# EAGLE schematic power_dist (EAGLE 9.6.0)
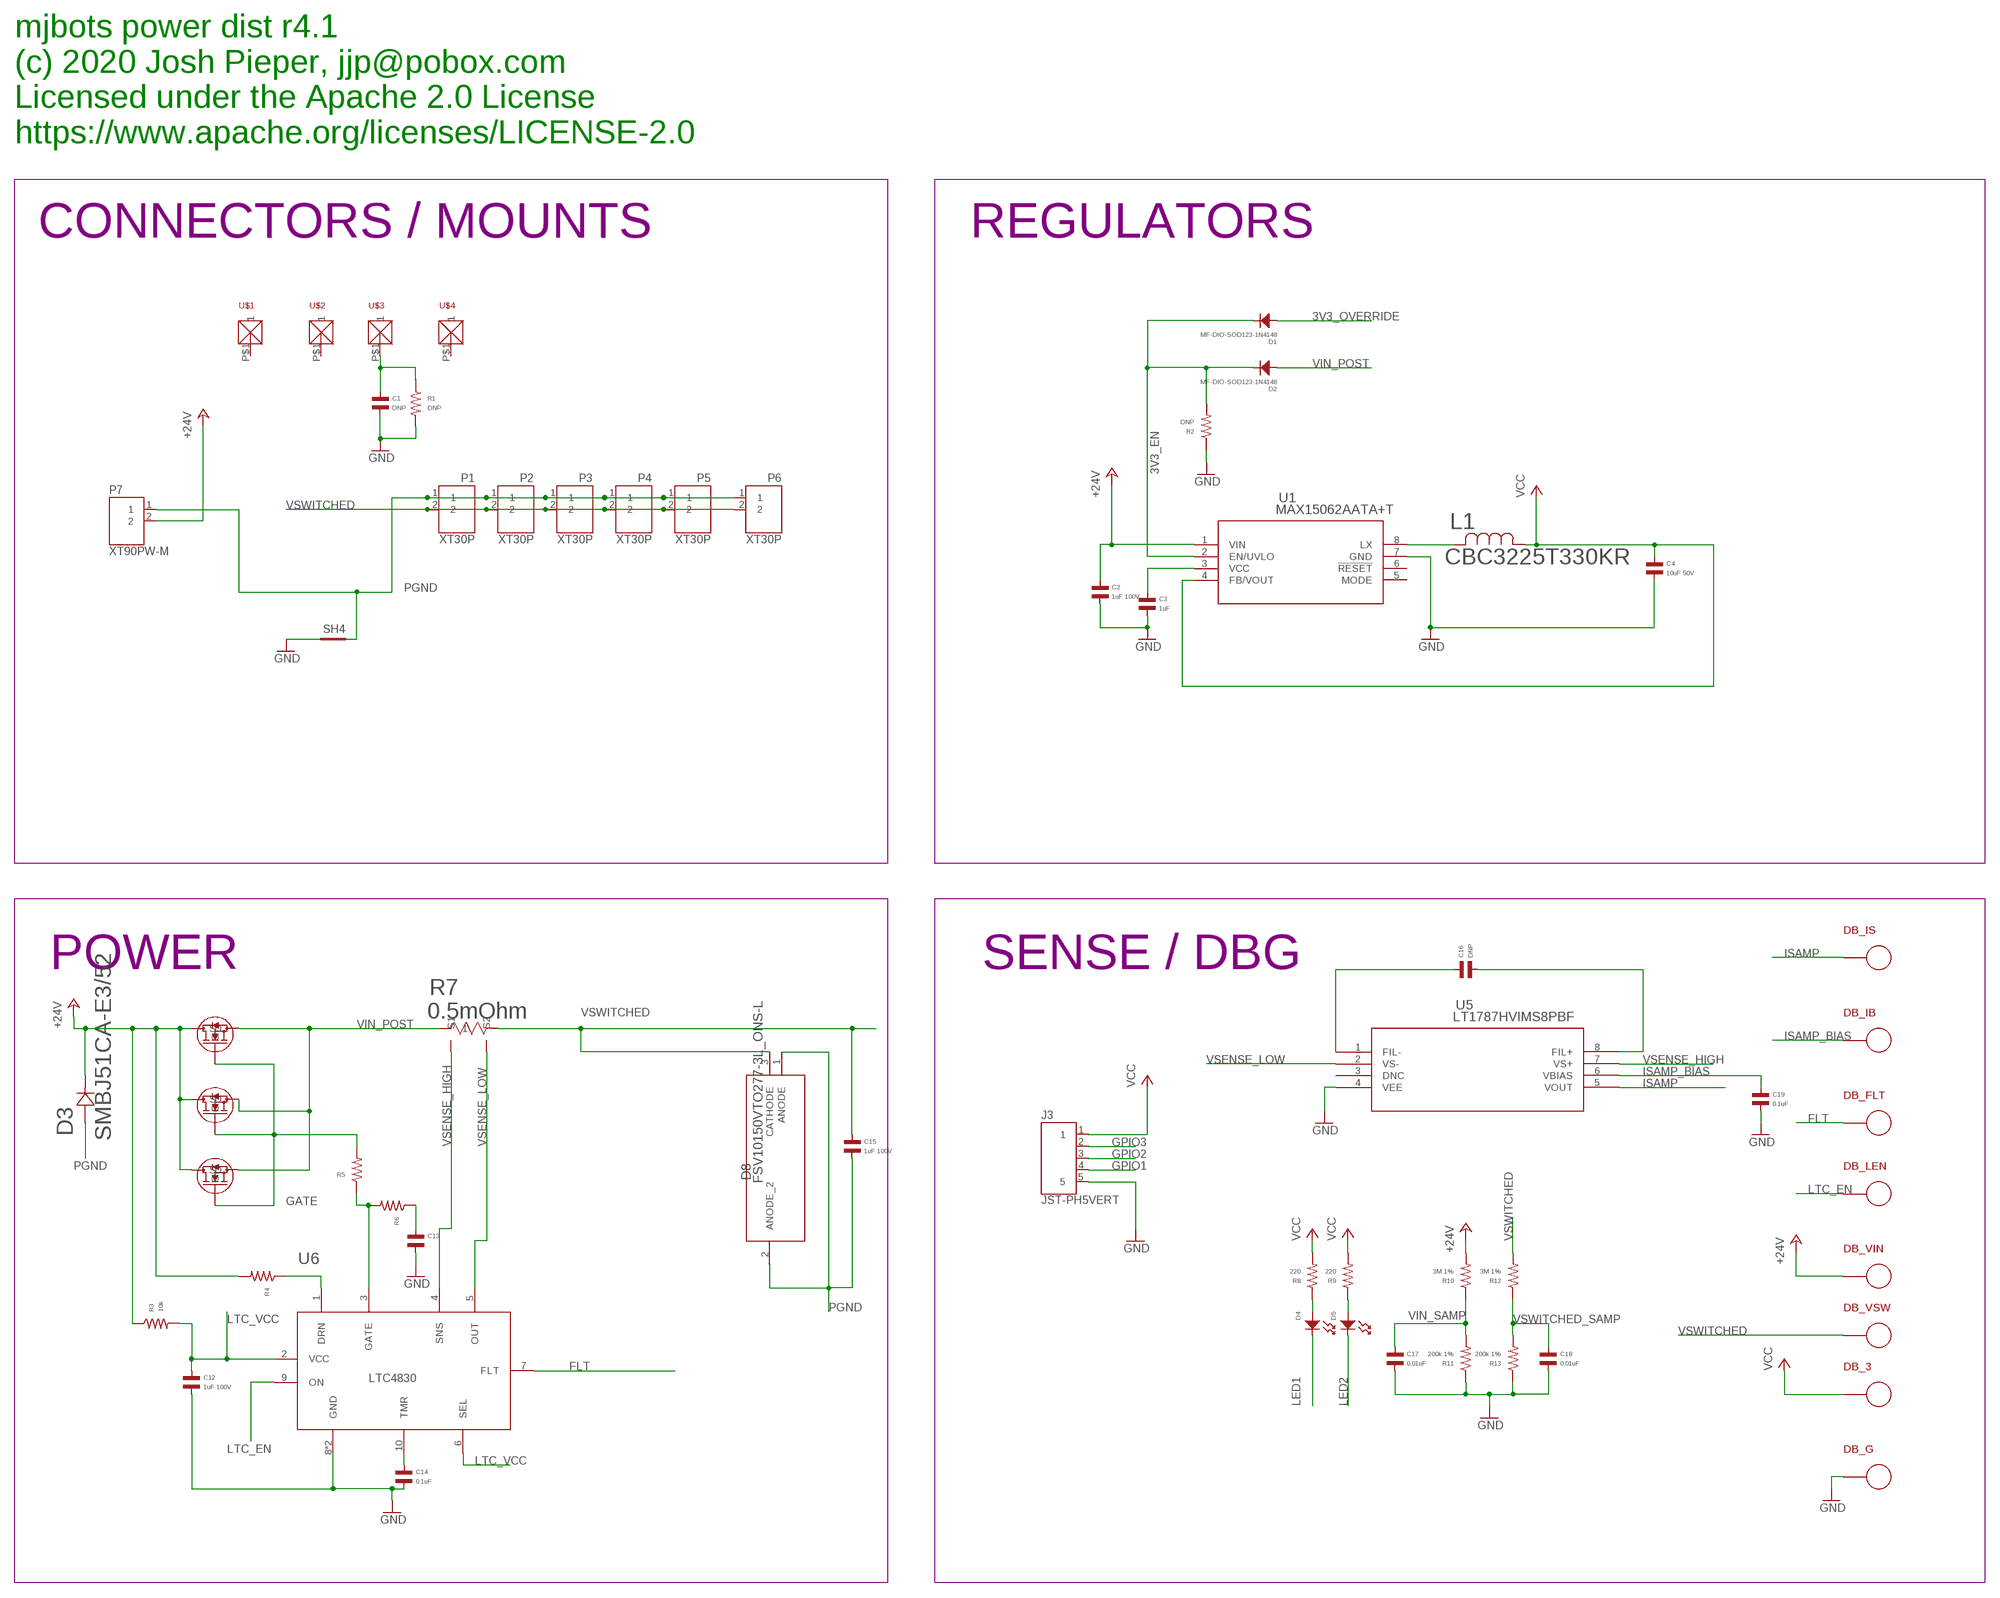
[diagram p0: schematic, sheet 1, part 1 of 2]
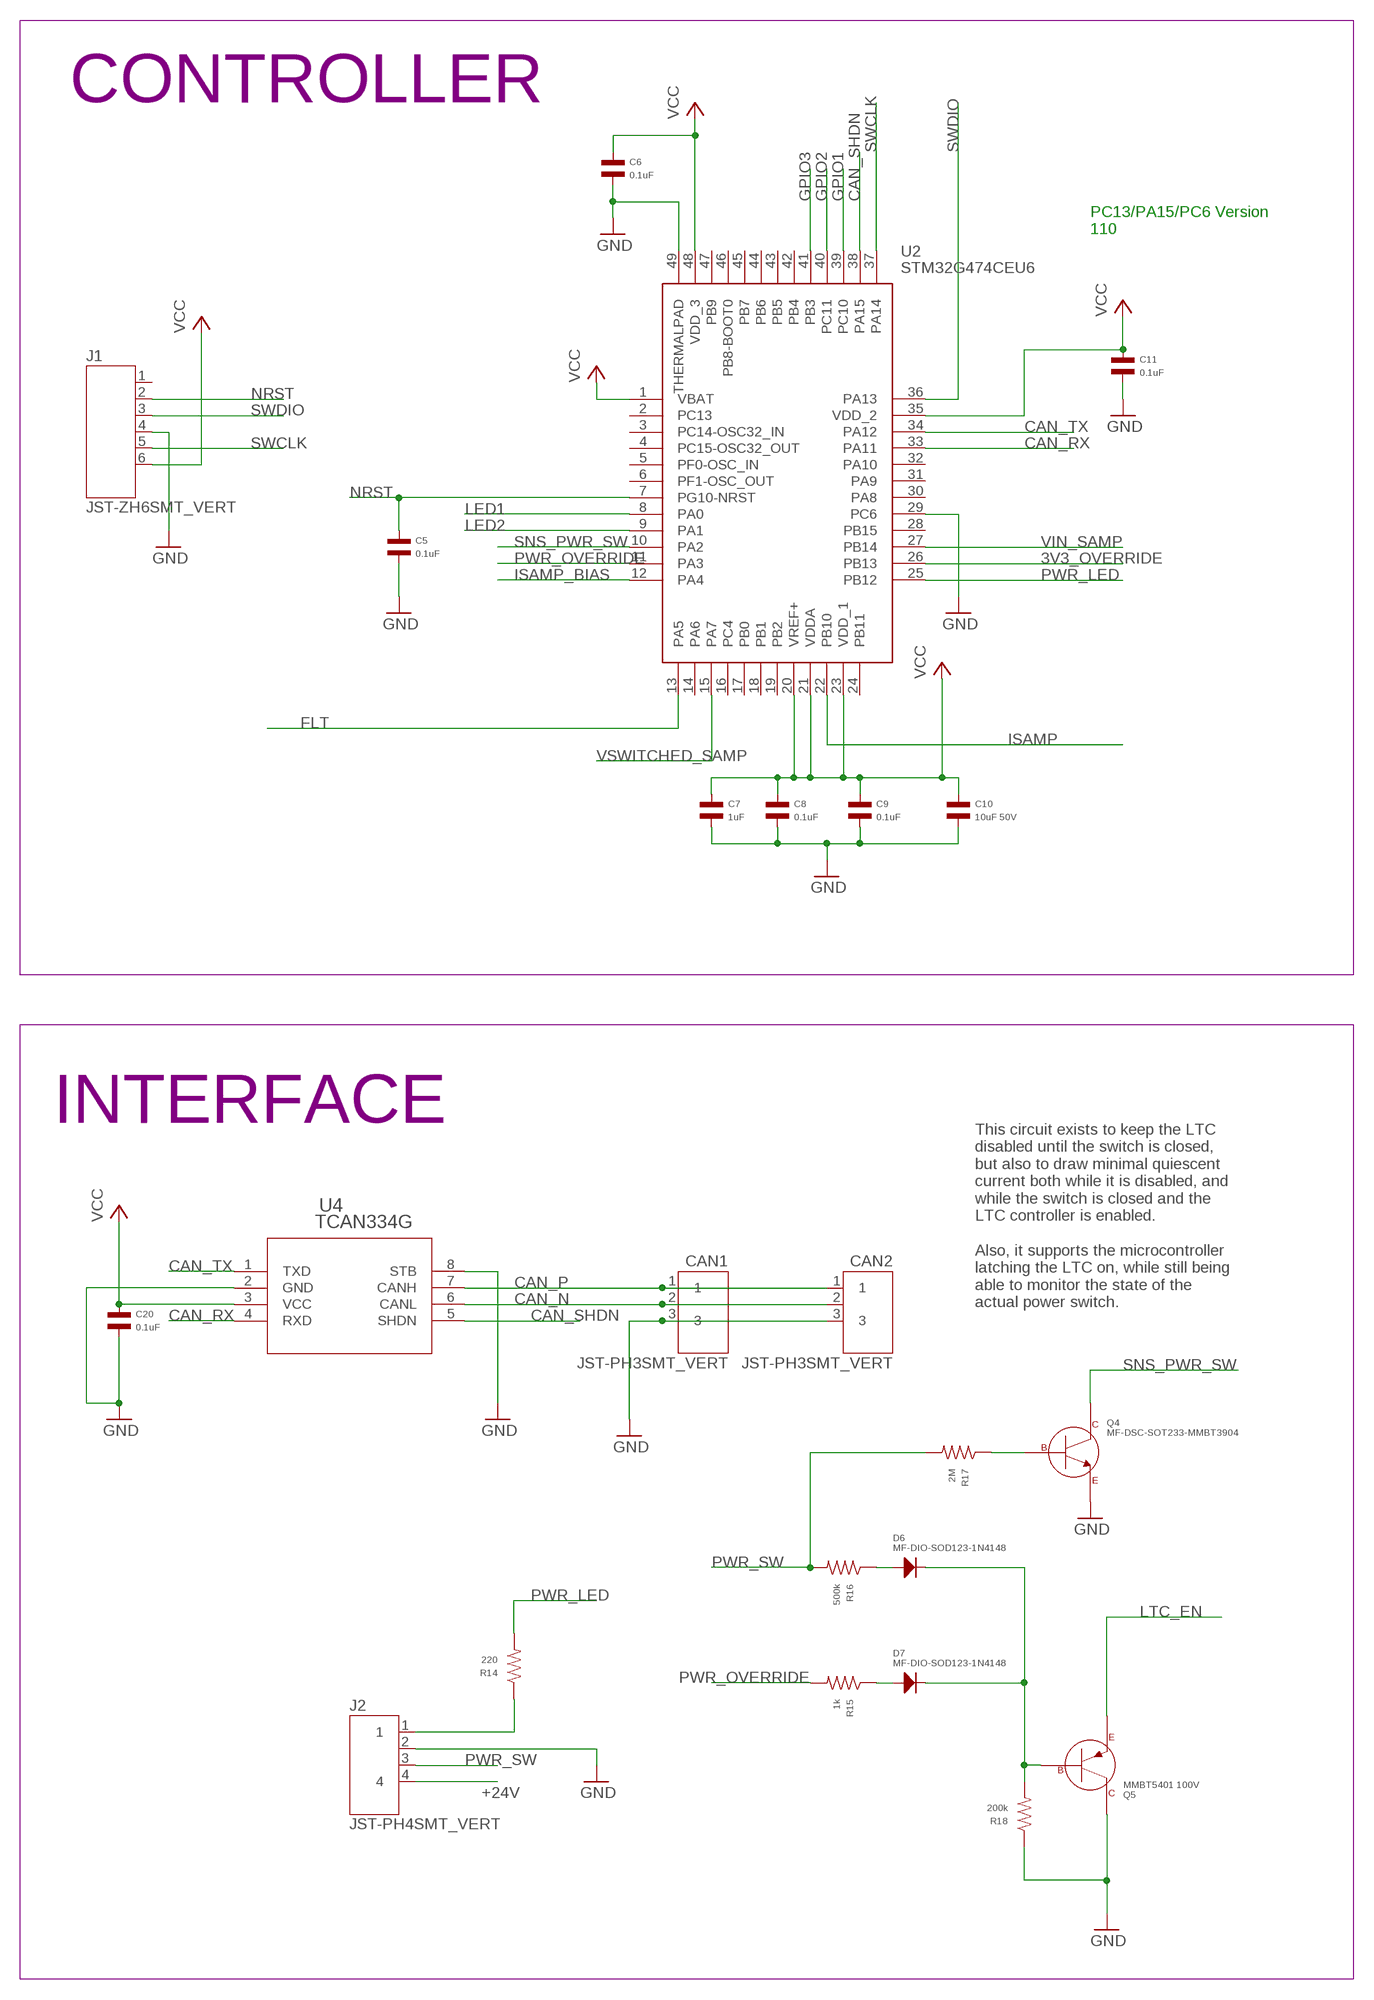
[diagram p1: schematic, sheet 1, part 2 of 2]

## Parts
C1  DNP  CAPACITOR_NP_0603  [C0603]
C2  1uF 100V  CAPACITOR_NP_0805  [C0805]
C3  1uF  CAPACITOR_NP_0603  [C0603]
C4  10uF 50V  CAPACITOR_NP_1206  [C1206]
C5  0.1uF  CAPACITOR_NP_0603  [C0603]
C6  0.1uF  CAPACITOR_NP_0603  [C0603]
C7  1uF  CAPACITOR_NP_0603  [C0603]
C8  0.1uF  CAPACITOR_NP_0603  [C0603]
C9  0.1uF  CAPACITOR_NP_0603  [C0603]
C10  10uF 50V  CAPACITOR_NP_1206  [C1206]
C11  0.1uF  CAPACITOR_NP_0603  [C0603]
C12  1uF 100V  CAPACITOR_NP_0805  [C0805]
C13  CAPACITOR_NP_0603  [C0603]
C14  0.1uF  CAPACITOR_NP_0603  [C0603]
C15  1uF 100V  CAPACITOR_NP_0805  [C0805]
C16  DNP  CAPACITOR_NP_0603  [C0603]
C17  0.01uF  CAPACITOR_NP_0603  [C0603]
C18  0.01uF  CAPACITOR_NP_0603  [C0603]
C19  0.1uF  CAPACITOR_NP_0603  [C0603]
C20  0.1uF  CAPACITOR_NP_0603  [C0603]
CAN1  JST-PH3SMT_VERT  [JST_B3B_PH-SM4-TB(LF)(SN)]
CAN2  JST-PH3SMT_VERT  [JST_B3B_PH-SM4-TB(LF)(SN)]
D1  MF-DIO-SOD123-1N4148  DIODES_1N4148_SOD-123  [SOD-123]
D2  MF-DIO-SOD123-1N4148  DIODES_1N4148_SOD-123  [SOD-123]
D3  SMBJ51CA-E3/52  [DIODE_DO-214AC]
D4  LED_SINGLE-0603  [LED0603]
D5  LED_SINGLE-0603  [LED0603]
D6  MF-DIO-SOD123-1N4148  DIODES_1N4148_SOD-123  [SOD-123]
D7  MF-DIO-SOD123-1N4148  DIODES_1N4148_SOD-123  [SOD-123]
D8  FSV10150VTO277-3L_ONS-L  [TO277-3L_ONS-L]
DB_3  PAD24AWG_PAD  [24AWG_PAD]
DB_FLT  PAD24AWG_PAD  [24AWG_PAD]
DB_G  PAD24AWG_PAD  [24AWG_PAD]
DB_IB  PAD24AWG_PAD  [24AWG_PAD]
DB_IS  PAD24AWG_PAD  [24AWG_PAD]
DB_LEN  PAD24AWG_PAD  [24AWG_PAD]
DB_VIN  PAD24AWG_PAD  [24AWG_PAD]
DB_VSW  PAD24AWG_PAD  [24AWG_PAD]
J1  JST-ZH6SMT_VERT  [JST_B6B-ZR-SM4-TF(LF)(SN)]
J2  JST-PH4SMT_VERT  [JST_B4B_PH-SM4-TB(LF)(SN)]
J3  JST-PH5VERT  [JST_B5B_PH-SM4-TB(LF)(SN)]
L1  CBC3225T330KR  [IND_TAIYO_CBC3225_TAY]
P1  XT30P  [XT30P]
P2  XT30P  [XT30P]
P3  XT30P  [XT30P]
P4  XT30P  [XT30P]
P5  XT30P  [XT30P]
P6  XT30P  [XT30P]
P7  XT90PW-M  [XT90PW-M]
Q1  PSMN4R8-100BSEJ  [D2PAK_SOT404_NEX]
Q2  PSMN4R8-100BSEJ  [D2PAK_SOT404_NEX]
Q3  PSMN4R8-100BSEJ  [D2PAK_SOT404_NEX]
Q4  MF-DSC-SOT233-MMBT3904  NPN_BJTMMBT3904_SOT-23-3  [SOT-23-3]
Q5  MMBT5401 100V  PNP_BJT_MMBT3906_SOT-23-3  [SOT-23-3]
R1  DNP  RESISTOR_0603  [R0603]
R2  DNP  RESISTOR_0603  [R0603]
R3  10k  RESISTOR_0603  [R0603]
R4  RESISTOR_0603  [R0603]
R5  RESISTOR_0603  [R0603]
R6  RESISTOR_0603  [R0603]
R7  0.5mOhm  SENSE_RESISTOR2512  [SHUNT2512]
R8  220  RESISTOR_0603  [R0603]
R9  220  RESISTOR_0603  [R0603]
R10  3M 1%  RESISTOR_0603  [R0603]
R11  200k 1%  RESISTOR_0603  [R0603]
R12  3M 1%  RESISTOR_0603  [R0603]
R13  200k 1%  RESISTOR_0603  [R0603]
R14  220  RESISTOR_0603  [R0603]
R15  1k  RESISTOR_0603  [R0603]
R16  500k  RESISTOR_0603  [R0603]
R17  2M  RESISTOR_0603  [R0603]
R18  200k  RESISTOR_0603  [R0603]
SH4  SHORTBIG  [SHORT_TOP-BIG]
U1  MAX15062AATA+T  [21-0487A_MXM]
U2  STM32G474CEU6  [QFN50P700X700X60-49N]
U4  TCAN334G  [SOIC8]
U5  LT1787HVIMS8PBF  [MSOP-8_MS]
U6  LTC4830  [DFN10]
U$1  MOUNT  [M2.5MOUNT]
U$2  MOUNT  [M2.5MOUNT]
U$3  MOUNT  [M2.5MOUNT]
U$4  MOUNT  [M2.5MOUNT]

## Nets
3V3_EN: D1.CATHODE D2.CATHODE R2.P$2 U1.2(EN/UVLO)
3V3_OVERRIDE: D1.ANODE U2.26(PB13)
+24V: C2.P$1 D3.1 DB_VIN.P$1 J2.4 P7.2 Q1.2(D) Q2.2(D) Q3.2(D) R3.P$1 R4.P$2 R10.P$2 U1.1(VIN)
CAN_N: CAN1.2 CAN2.2 U4.6(CANL)
CAN_P: CAN1.1 CAN2.1 U4.7(CANH)
CAN_RX: U2.33(PA11) U4.4(RXD)
CAN_SHDN: U2.38(PA15) U4.5(SHDN)
CAN_TX: U2.34(PA12) U4.1(TXD)
FLT: DB_FLT.P$1 U2.13(PA5) U6.7(FLT)
GATE: Q1.1(G) Q2.1(G) Q3.1(G) R5.P$2
GND: C1.P$2 C2.P$2 C3.P$2 C4.P$2 C5.P$2 C6.P$2 C7.P$2 C8.P$2 C9.P$2 C10.P$2 C11.P$2 C12.P$2 C13.P$2 C14.P$2 C17.P$2 C18.P$2 C19.P$2 C20.P$2 CAN1.3 CAN2.3 DB_G.P$1 J1.4 J2.2 J3.5 Q4.P$2(EMITTER) Q5.P$3(COLLECTOR) R1.P$2 R2.P$1 R11.P$1 R13.P$1 R18.P$1 SH4.1 U1.7(GND) U2.29(PC6) U2.49(THERMALPAD) U4.2(GND) U4.8(STB) U5.4(VEE) U6.8(GND) U6.P$1(GND)
GPIO1: J3.4 U2.39(PC10)
GPIO2: J3.3 U2.40(PC11)
GPIO3: J3.2 U2.41(PB3)
ISAMP: DB_IS.P$1 U2.22(PB10) U5.5(VOUT)
ISAMP_BIAS: C19.P$1 DB_IB.P$1 U2.12(PA4) U5.6(VBIAS)
LED1: D4.CATHODE U2.8(PA0)
LED2: D5.CATHODE U2.9(PA1)
LTC_EN: DB_LEN.P$1 Q5.P$2(EMITTER) U6.9(ON)
LTC_VCC: C12.P$1 R3.P$2 U6.2(VCC) U6.6(SEL)
N$1: L1.2 U1.8(LX)
N$2: J2.1 R14.P$1
N$4: C3.P$1 U1.3(VCC)
N$5: R5.P$1 R6.P$2 U6.3(GATE)
N$6: C16.P$1 U5.1(FIL-)
N$7: C16.P$2 U5.8(FIL+)
N$8: D4.ANODE R8.P$1
N$9: C13.P$1 R6.P$1
N$10: R4.P$1 U6.1(DRN)
N$11: Q4.P$1(BASE) R17.P$1
N$12: C14.P$1 U6.10(TMR)
N$13: D6.CATHODE D7.CATHODE Q5.P$1(BASE) R18.P$2
N$14: D5.ANODE R9.P$1
N$15: C1.P$1 R1.P$1 U$3.P$1
N$17: D6.ANODE R16.P$1
N$18: D7.ANODE R15.P$1
NRST: C5.P$1 J1.2 U2.7(PG10-NRST)
PGND: C15.P$2 D3.2 D8.1(ANODE) D8.2(ANODE_2) P1.1 P2.1 P3.1 P4.1 P5.1 P6.1 P7.1 SH4.2
PWR_LED: R14.P$2 U2.25(PB12)
PWR_OVERRIDE: R15.P$2 U2.11(PA3)
PWR_SW: J2.3 R16.P$2 R17.P$2
SNS_PWR_SW: Q4.P$3(COLLECTOR) U2.10(PA2)
SWCLK: J1.5 U2.37(PA14)
SWDIO: J1.3 U2.36(PA13)
VCC [power]: C4.P$1 C6.P$1 C7.P$1 C8.P$1 C9.P$1 C10.P$1 C11.P$1 C20.P$1 DB_3.P$1 J1.6 J3.1 L1.1 R8.P$2 R9.P$2 U1.4(FB/VOUT) U2.1(VBAT) U2.20(VREF+) U2.21(VDDA) U2.23(VDD_1) U2.35(VDD_2) U2.48(VDD_3) U4.3(VCC)
VIN_POST: D2.ANODE Q1.3(S) Q2.3(S) Q3.3(S) R7.1
VIN_SAMP: C17.P$1 R10.P$1 R11.P$2 U2.27(PB14)
VSENSE_HIGH: R7.3(S1) U5.7(VS+) U6.4(SNS)
VSENSE_LOW: R7.4(S2) U5.2(VS-) U6.5(OUT)
VSWITCHED: C15.P$1 D8.3(CATHODE) DB_VSW.P$1 P1.2 P2.2 P3.2 P4.2 P5.2 P6.2 R7.2 R12.P$2
VSWITCHED_SAMP: C18.P$1 R12.P$1 R13.P$2 U2.15(PA7)
Unconnected: J1.1 U1.5(MODE) U1.6(!RESET) U2.2(PC13) U2.3(PC14-OSC32_IN) U2.4(PC15-OSC32_OUT) U2.5(PF0-OSC_IN) U2.6(PF1-OSC_OUT) U2.14(PA6) U2.16(PC4) U2.17(PB0) U2.18(PB1) U2.19(PB2) U2.24(PB11) U2.28(PB15) U2.30(PA8) U2.31(PA9) U2.32(PA10) U2.42(PB4) U2.43(PB5) U2.44(PB6) U2.45(PB7) U2.46(PB8-BOOT0) U2.47(PB9) U5.3(DNC) U$1.P$1 U$2.P$1 U$4.P$1

## Notes on the sheet
- mjbots power dist r4.1
  (c) 2020 Josh Pieper, jjp@pobox.com
  Licensed under the Apache 2.0 License
  https://www.apache.org/licenses/LICENSE-2.0
- CONNECTORS / MOUNTS | REGULATORS | CONTROLLER
- PC13/PA15/PC6 Version
  110
- POWER | SENSE / DBG | INTERFACE
- This circuit exists to keep the LTC 
  disabled until the switch is closed, 
  but also to draw minimal quiescent 
  current both while it is disabled, and 
  while the switch is closed and the 
  LTC controller is enabled.
  
  Also, it supports the microcontroller
  latching the LTC on, while still being
  able to monitor the state of the
  actual power switch.

## Library data of the parts
C1 C16 = mfpassives:CAPACITOR_NP: Library: MF_Passives Description: Device for Non-Polarized Capacitors. Manufacture part number (MPN) can be added via Attributes. Check https://factory.macrofab.com/parts for the house parts list.; POPULATE: 0
C2 C12 C15 = mfpassives:CAPACITOR_NP: Library: MF_Passives Description: Device for Non-Polarized Capacitors. Manufacture part number (MPN) can be added via Attributes. Check https://factory.macrofab.com/parts for the house parts list.; MF: MURATA; MPN: GCM21BC72A105KE36L; POPULATE: 1
C3 C7 = mfpassives:CAPACITOR_NP: Library: MF_Passives Description: Device for Non-Polarized Capacitors. Manufacture part number (MPN) can be added via Attributes. Check https://factory.macrofab.com/parts for the house parts list.; HOUSEPART: 1; MPN: MF-CAP-0603-1uF; POPULATE: 1
C4 C10 = mfpassives:CAPACITOR_NP: Library: MF_Passives Description: Device for Non-Polarized Capacitors. Manufacture part number (MPN) can be added via Attributes. Check https://factory.macrofab.com/parts for the house parts list.; MF: TDK; MPN: C3216X7R1H106K160AE; POPULATE: 1
C5 C6 C8 C9 C11 C14 C19 C20 = mfpassives:CAPACITOR_NP: Library: MF_Passives Description: Device for Non-Polarized Capacitors. Manufacture part number (MPN) can be added via Attributes. Check https://factory.macrofab.com/parts for the house parts list.; HOUSEPART: 1; MPN: MF-CAP-0603-0.1uF; POPULATE: 1
C13 = mfpassives:CAPACITOR_NP: Library: MF_Passives Description: Device for Non-Polarized Capacitors. Manufacture part number (MPN) can be added via Attributes. Check https://factory.macrofab.com/parts for the house parts list.; HOUSEPART: 1; POPULATE: 1
C17 C18 = mfpassives:CAPACITOR_NP: Library: MF_Passives Description: Device for Non-Polarized Capacitors. Manufacture part number (MPN) can be added via Attributes. Check https://factory.macrofab.com/parts for the house parts list.; HOUSEPART: 1; MPN: MF-CAP-0603-0.01uF; POPULATE: 1
CAN1 CAN2 = precharge:JST-PH3; MF: JST; MPN: B3B-PH-SM4-TB(LF)(SN); POPULATE: 1
D1 D2 D6 D7 = mfdiscretesemi:DIODES: Library: MF_Discrete_Semiconductor Description: Device for Single Packaged Diodes.; HOUSEPART: YES; MPN: MF-DIO-SOD123-1N4148; POPULATE: 1; URL: https://factory.macrofab.com/part/MF-DIO-SOD123-1N4148
D3 = power_dist:SMBJ51CA-E3/52; BUILT_BY: EMA_UL_Team; MANUFACTURER_PART_NUMBER: SMBJ51CA-E3/52; MPN: SMBJ51CA-E3/52; POPULATE: 1; VENDOR: Vishay
D4 D5 = mfleds:LED_SINGLE: Library: MF_LEDs Description: Device for Single LED Packages. Manufacture part number (MFG#) can be added via Attributes.; HOUSEPART: 1; MPN: MF-LED-0603-RED; POPULATE: 1
D8 = power_dist:FSV10150V; BUILT_BY: EMA_Jessica; COPYRIGHT: Copyright (C) 2018 Accelerated Designs. All rights reserved; MANUFACTURER_PART_NUMBER: FSV10150V; MPN: FSV10150V; POPULATE: 1; SOURCELIBRARY: ON_Semiconductor_2019-12-30; VENDOR: ON Semiconductor
DB_3 DB_FLT DB_G DB_IB DB_IS DB_LEN DB_VIN DB_VSW = precharge:PAD; POPULATE: 0
J1 = precharge:JST-ZH6; MF: JST; MPN: B6B-ZR-SM4-TF(LF)(SN); POPULATE: 1
J2 = precharge:JST-PH4; MF: JST; MPN: B4B-PH-SM4-TB(LF)(SN); POPULATE: 1
J3 = power_dist:JST-PH5; MF: JST; MPN: B5B-PH-SM4-TB(LF)(SN); POPULATE: 1
L1 = power_dist:CBC3225T330KR; BUILT_BY: EMA_UL_Team; MANUFACTURER_PART_NUMBER: CBC3225T330KR; MPN: CBC3225T330KR; POPULATE: 1; SOURCELIBRARY: TaiyoYuden_2011-01-01_IND_CB; VENDOR: TAIYO YUDEN
P1-P6 = precharge:XT30; MF: AMASS; MPN: XT30UPB-F; POPULATE: 1
P7 = power_dist:XT90; POPULATE: 0
Q1-Q3 = power_dist:PSMN4R8-100BSEJ; BUILT_BY: EMA_Cory; COPYRIGHT: Copyright (C) 2018 Accelerated Designs. All rights reserved; DATASHEET: https://assets.nexperia.com/documents/data-sheet/PSMN4R8-100BSE.pdf; MANUFACTURER_PART_NUMBER: PSMN4R8-100BSEJ; MPN: PSMN4R8-100BSEJ; POPULATE: 1; SOURCELIBRARY: Nexperia_2020-02-27; VENDOR: Nexperia
Q4 = mfdiscretesemi:NPN_BJT: Library: MF_Discrete_Semiconductor Description: Device for Single NPN BJT Transistors. Manufacture part number (MFG#) can be added via Attributes.; HOUSEPART: YES; MPN: MF-DSC-SOT233-MMBT3904; POPULATE: 1; URL: https://factory.macrofab.com/part/MF-DSC-SOT233-MMBT3904
Q5 = mfdiscretesemi:PNP_BJT: Library: MF_Discrete_Semiconductor Description: Device for Single PNP BJT Transistors. Manufacture part number (MFG#) can be added via Attributes.; MF: DIODES; MPN: MMBT5401-7-F; POPULATE: 1; VALUE: MF-DSC-SOT233-MMBT3906
R1 = mfpassives:RESISTOR: Library: MF_Passives Description: Device for Resistors. Manufacture part number (MPN), Voltage, Tolerance, and Wattage Rating can be added via Attributes. Check https://factory.macrofab.com/parts for the house parts list.; POPULATE: 0
R2-R6 R10-R13 R15-R18 = mfpassives:RESISTOR: Library: MF_Passives Description: Device for Resistors. Manufacture part number (MPN), Voltage, Tolerance, and Wattage Rating can be added via Attributes. Check https://factory.macrofab.com/parts for the house parts list.; HOUSEPART: 1; POPULATE: 1
R7 = power_dist:SENSE_RESISTOR; MF: VISHAY DALE; MPN: WSLF2512L5000FEA; POPULATE: 1
R8 R9 R14 = mfpassives:RESISTOR: Library: MF_Passives Description: Device for Resistors. Manufacture part number (MPN), Voltage, Tolerance, and Wattage Rating can be added via Attributes. Check https://factory.macrofab.com/parts for the house parts list.; HOUSEPART: 1; MPN: MF-RES-0603-220; POPULATE: 1
SH4 = shorts:SHORT: Short between two nets; POPULATE: 0
U1 = power_dist:MAX15062AATA+T; BUILT_BY: EMA_Jessica; COPYRIGHT: Copyright (C) 2018 Accelerated Designs. All rights reserved; MANUFACTURER_PART_NUMBER: MAX15062AATA+T; MPN: MAX15062AATA+T; POPULATE: 1; REVISION: 1; SOURCELIBRARY: Maxim_DP_2018-06-12; VENDOR: Maxim Integrated Products
U2 = precharge:STM32G474CEU6: STMICROELECTRONICS - STM32G474CEU6 - MCU, 32BIT, 170MHZ, UFQFPN-48 Source: Datasheet <https://componentsearchengine.com/Datasheets/1/STM32G474CEU6.pdf>; DESCRIPTION: STMICROELECTRONICS - STM32G474CEU6 - MCU, 32BIT, 170MHZ, UFQFPN-48; HEIGHT: 0.6mm; MANUFACTURER_NAME: STMicroelectronics; MANUFACTURER_PART_NUMBER: STM32G474CEU6; MF: ST; MOUSER_PART_NUMBER: 511-STM32G474CEU6; MOUSER_PRICE-STOCK: https://www.mouser.com/Search/Refine.aspx?Keyword=511-STM32G474CEU6; MPN: STM32G474CEU6; POPULATE: 1
U4 = precharge:TCAN334G; MF: TI; MPN: TCAN334GDR; POPULATE: 1
U5 = LT1787HVIMS8PBF:LT1787HVIMS8PBF; DESCRIPTION: Current Sense Amplifier 1 Circuit 8-MSOP; DIGI-KEY_PART_NUMBER: LT1787HVIMS8#PBF-ND; MF: Linear Technology; MP: LT1787HVIMS8#PBF; PACKAGE: MSOP-8 Linear Technology; PURCHASE-URL: https://pricing.snapeda.com/search/part/LT1787HVIMS8#PBF/?ref=eda
U6 = power_dist:LTC4830
U$1-U$4 = power_dist:MOUNT; POPULATE: 0

## Net classes
1 power: width 0.254 mm